# Altium schematic sheet BTL_DLCN.SchDoc
size A2; SheetNumber: 1; SheetTotal: 1
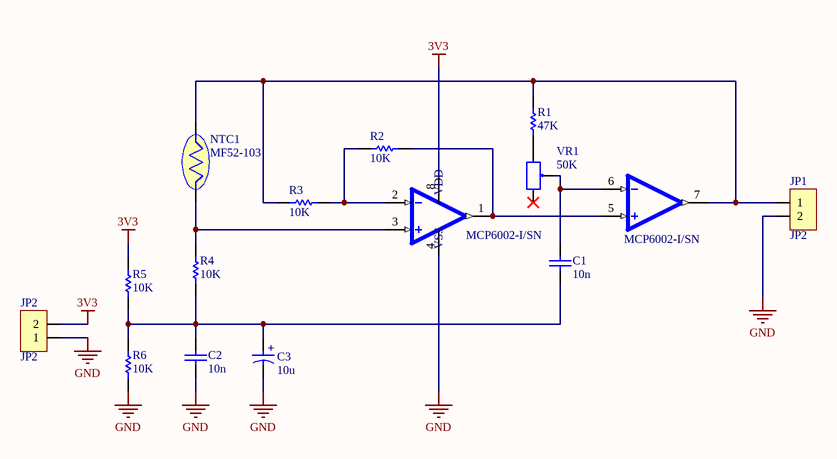
[diagram p0: BTL_DLCN.SchDoc]

## Parts
C1  10n  [CAP_0805]
C2  10n  [CAP_0805]
C3  10u  [WCAP-ASLI_D5H5.5]
JP1  JP2  [JP2-D1T]
JP2  JP2  [JP2-D1T]
NTC1  MF52-103  [NTC10D]
R1  47K  [RESISTOR_0805]
R2  10K  [RESISTOR_0805]
R3  10K  [RESISTOR_0805]
R4  10K  [RESISTOR_0805]
R5  10K  [RESISTOR_0805]
R6  10K  [RESISTOR_0805]
U1  MCP6002-I/SN  [SOIC127P600X175-8N]  (parts A,B of 2)
VR1  50K  [VR-S3]

## Nets
3V3: JP2.2 R5.1 U1.8(VDD)
GND: C2.1 C3.2(N) JP1.2 JP2.1 R6.2 U1.4(VSS)
NetC1_1: C1.1 C2.2 C3.1(P) R4.2 R5.2 R6.1
NetC1_2: C1.2 U1.6(VINB-) VR1.2
NetJP1_1: JP1.1 NTC1.2 R1.2 R3.2 U1.7(VOUTB)
NetNTC1_1: NTC1.1 R4.1 U1.3(VINA+)
NetR1_1: R1.1 VR1.1
NetR2_1: R2.1 U1.1(VOUTA) U1.5(VINB+)
NetR2_2: R2.2 R3.1 U1.2(VINA-)

Not connected (* = marked no-connect by the designer): VR1 3*

## Notes on the sheet
- (in symbol 865080142007) +

## Library data of the parts
C1 C2 = 0108052781050: CAP, size 0805, 2.7 uF, 50 VDC; Manufacture Name: TDK; Manufacture SN: CGA4C2C0G1H272J060AA; Capacitance: 2.7 uF; Tolerance: +/-5%; Voltage Rating DC: 50 VDC; ComponentLink2Description: Datasheet; ComponentLink2URL: https://product.tdk.com/system/files/dam/doc/product/capacitor/ceramic/mlcc/catalog/mlcc_automotive_general_en.pdf?ref_disty=mouser; Operating Temperature: -55 to +125degC; Packaging: Tape and Reel; Mounting Technology: SMT; Size: 0805; Supplier 1 Name: Mouser; Supplier 1 SN: 810-CGA4C2C0G1H272J; Supplier 1 URL: https://www.mouser.vn/ProductDetail/TDK/CGA4C2C0G1H272J060AA?qs=FxQuwy19cyDK2SI%2FAkg0pQ%3D%3D&utm_source=mouser-refine-download&utm_medium=file&utm_campaign=CGA4C2C0G1H272J060AA&utm_content=TDK; Supplier 2 Name: Digi-Key; Supplier 2 SN: 445-5674-2-ND; Supplier 2 URL: https://www.digikey.com/en/products/detail/tdk-corporation/cga4c2c0g1h272j060aa/2443152; Supplier 3 Name: thegioiic; Supplier 3 SN: OEM; Supplier 3 URL: N/A; Value: 2.7 uF, 50 VDC
C3 = 865080142007: V-Chip, D5 x H5.5mm, 100uF, 6.3V; Manufacturer: Wurth Elektronik; Capacitance Tolerance: +/-20%; Dissipation Factor: 24%; Endurance: 2000h; Leakage Current: 6.3uA; Ripple Current: 170mA; Category: Aluminum Electrolytic Capacitors; ComponentLink2Description: Datasheet Link; ComponentLink2URL: https://www.we-online.com/redexpert/spec/865080142007?ad; Operating Temperature Max: 105°C; Operating Temperature Min: -55°C; Packaging: Tape and Reel; Height: 5.5mm; Diameter: 5mm; Capacitance: 100uF; Rated Voltage (DC): 6.3V; Supplier 1 Name: Mouser; Supplier 1 SN: 710-865080142007; Supplier 1 URL: https://www.mouser.vn/ProductDetail/Wurth-Elektronik/865080142007?qs=0KOYDY2FL2%2Fwso3YmuIP2w%3D%3D; Supplier 3 Name: thegioiic; Supplier 3 URL: https://www.thegioiic.com/tu-nhom-smd-100uf-10v-5x5-4mm-panasonic-eee1aa101war; Manufacturer Part Number: N/A; Mount: Surface Mount; Supplier 2 Name: Digi-Key; Supplier 2 SN: N/A; Supplier 2 URL: N/A; Supplier 3 SN: N/A; Value: 100uF, 6.3V
JP1 JP2 = JP2: WR-PHD 2.54 mm Angled Socket Header; Manufacturer: W¨¹rth Elektronik eiSos GmbH; partNo: 613002143121; ComponentLink1 Description: Manufacturer; ComponentLink2 Description: Datasheet; NoPins: 02; Created Date: 29 March 2013; ComponentLink1URL: http://www.we-online.com; ComponentLink2URL: http://katalog.we-online.de/em/datasheet/6130xx143121.pdf; Created by: Karrer Zheng
NTC1 = NTC10D
R1 = 0008054755: https://www.thegioiic.com/dien-tro-47-kohm-0805-1-; Resistance: 4.7 MOhm; Resistance Tolerance: +/-1%; Rated Power: 1/8 W; Value: 4.7 MOhm, 1/8W; Size: 0805; Supplier 1 Name: Mouser; Supplier 1 SN: 603-RV0805JR-074M7L; Supplier 1 URL: https://www.mouser.vn/ProductDetail/YAGEO/RV0805JR-074M7L?qs=XvqVlMQ4V3WjwKR%2FSBdWbg%3D%3D; Supplier 2 Name: Digi-Key; Supplier 2 SN: 311-4.7MARTR-ND; Supplier 2 URL: https://www.digikey.com/en/products/detail/yageo/RC0805JR-074M7L/728328; Mounting Technology: SMT; Supplier 3 Name: Thegioiic; Supplier 3 SN: N/A; Supplier 3 URL: N/A; Manufacture  Name: N/A; Manufacture  SN: N/A; ComponentLink1Description: Datasheet link; ComponentLink1URL: N/A; ComponentLink2Description: Supplier 1 URL; ComponentLink2URL: https://www.mouser.vn/ProductDetail/YAGEO/RV0805JR-074M7L?qs=XvqVlMQ4V3WjwKR%2FSBdWbg%3D%3D; ComponentLink3Description: Supplier 2 URL; ComponentLink3URL: https://www.digikey.com/en/products/detail/yageo/RC0805JR-074M7L/728328; ComponentLink4Description: Supplier 3 URL; ComponentLink4URL: N/A
R2 R5 R6 = 0008054755: RES, size 0805, 4.7 MOhm, 1/8W; Resistance Tolerance: +/-1%; Resistance: 4.7 MOhm; Size: 0805; Rated Power: 1/8 W; Supplier 1 Name: Mouser; Supplier 1 SN: 603-RV0805JR-074M7L; Supplier 1 URL: https://www.mouser.vn/ProductDetail/YAGEO/RV0805JR-074M7L?qs=XvqVlMQ4V3WjwKR%2FSBdWbg%3D%3D; Supplier 2 Name: Digi-Key; Supplier 2 SN: 311-4.7MARTR-ND; Supplier 2 URL: https://www.digikey.com/en/products/detail/yageo/RC0805JR-074M7L/728328; Mounting Technology: SMT; Supplier 3 Name: Thegioiic; Supplier 3 SN: N/A; Supplier 3 URL: N/A; Manufacture  Name: N/A; Manufacture  SN: N/A; Value: 4.7 MOhm, 1/8W; ComponentLink1Description: Datasheet link; ComponentLink1URL: N/A; ComponentLink2Description: Supplier 1 URL; ComponentLink2URL: https://www.mouser.vn/ProductDetail/YAGEO/RV0805JR-074M7L?qs=XvqVlMQ4V3WjwKR%2FSBdWbg%3D%3D; ComponentLink3Description: Supplier 2 URL; ComponentLink3URL: https://www.digikey.com/en/products/detail/yageo/RC0805JR-074M7L/728328; ComponentLink4Description: Supplier 3 URL; ComponentLink4URL: N/A
R3 R4 = 0008054755: https://www.thegioiic.com/dien-tro-10-kohm-0805-1-; Resistance: 4.7 MOhm; Resistance Tolerance: +/-1%; Rated Power: 1/8 W; Value: 4.7 MOhm, 1/8W; Size: 0805; Supplier 1 Name: Mouser; Supplier 1 SN: 603-RV0805JR-074M7L; Supplier 1 URL: https://www.mouser.vn/ProductDetail/YAGEO/RV0805JR-074M7L?qs=XvqVlMQ4V3WjwKR%2FSBdWbg%3D%3D; Supplier 2 Name: Digi-Key; Supplier 2 SN: 311-4.7MARTR-ND; Supplier 2 URL: https://www.digikey.com/en/products/detail/yageo/RC0805JR-074M7L/728328; Mounting Technology: SMT; Supplier 3 Name: Thegioiic; Supplier 3 SN: N/A; Supplier 3 URL: N/A; Manufacture  Name: N/A; Manufacture  SN: N/A; ComponentLink1Description: Datasheet link; ComponentLink1URL: N/A; ComponentLink2Description: Supplier 1 URL; ComponentLink2URL: https://www.mouser.vn/ProductDetail/YAGEO/RV0805JR-074M7L?qs=XvqVlMQ4V3WjwKR%2FSBdWbg%3D%3D; ComponentLink3Description: Supplier 2 URL; ComponentLink3URL: https://www.digikey.com/en/products/detail/yageo/RC0805JR-074M7L/728328; ComponentLink4Description: Supplier 3 URL; ComponentLink4URL: N/A
U1 = MCP6002-I/SN: Microchip , Dual Op Amp, 1MHzCMOS, Rail to Rail, 3V, 5V, 8-Pin SOIC | Microchip Technology Inc. MCP6002-I/SN; SnapEDA_Link: https://www.snapeda.com/parts/MCP6002-I/SN/Microchip/view-part/?ref=snap; Package: SO-8 Microchip; Value: *; MF: Microchip; MP: MCP6002-I/SN; Check_prices: https://www.snapeda.com/parts/MCP6002-I/SN/Microchip/view-part/?ref=eda
VR1 = Resistor Var: https://www.thegioiic.com/3296w-503-bien-tro-chiet-ap-50-kohm-3-chan-chinh-top-0-5w